# EAGLE design light_sensor (EAGLE 7.3.1)
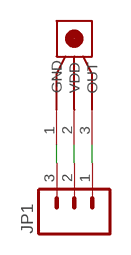
[diagram p0: schematic, sheet 1]

## Parts
JP1  M03PTH  [1X03]
U$1  TSL235TH  [TSL235_TH]

## Nets
N$1: JP1.1 U$1.3(OUT)
N$2: JP1.2 U$1.2(VDD)
N$3: JP1.3 U$1.1(GND)

## Library data of the parts
JP1 = SparkFun:M03: Header 3 Standard 3-pin 0.1" header. Use with straight break away headers (SKU : PRT-00116), right angle break away headers (PRT-00553), swiss pins (PRT-00743), machine pins (PRT-00117), and female headers (PRT-00115). Molex polarized connector foot print use with SKU : PRT-08232 with associated crimp pins and housings.
U$1 = Robin:TSL235

## Board
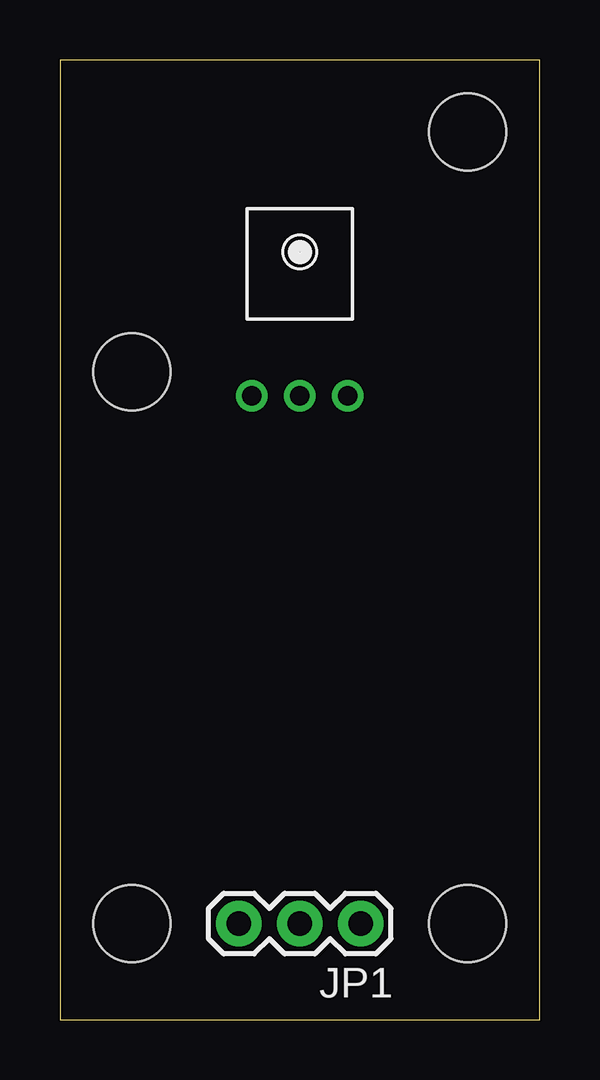
[diagram p1: board, top side]
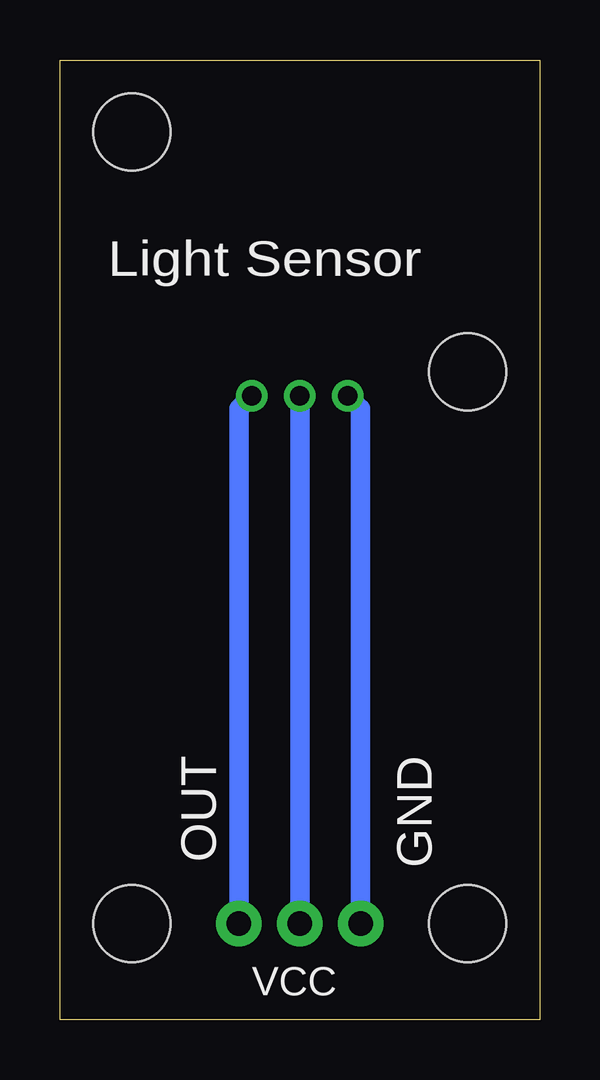
[diagram p2: board, bottom side, seen from below]

Size 20 x 40 mm. Coordinates in mm from the lower left corner, seen from the top.
Outline: 0,0 20,0 20,40 0,40 0,0
Copper layers (1*16): Top 0.035mm / dielectric 1.5mm / Bottom 0.035mm
Design rules "SeeedStudio_2layer_DRU_no_angle_20140221": minimum track width 6mil, minimum drill 12mil, track to track 6mil, track to pad 6mil, pad to pad 6mil, via to via 6mil, smd to smd 0mil, copper to edge 10mil, drill to drill 10mil, minimum pad ring 10mil, minimum via ring 6mil, stop-mask expansion 2mil, vias tented up to drill 100mil, thermal gap 10mil
Holes 3.2 mm at 3,4 17,37 17,4 3,27

### Footprints (pad centres in the part's own frame; a part is rotated, then mirrored left to right if it is on the bottom)
1X03 = drill 1.016 pad 1.88: 1 0,0; 2 2.54,0; 3 5.08,0
TSL235_TH = drill 0.8: 1 -2,-6; 2 0,-6; 3 2,-6

### Placement (x,y rotation side)
JP1  12.54,4 180 top
U$1  10,32 0 top

### Tracks (layer width: path | path; a pad name or v marks a point on that pad's centre or on a via)
N$1
  Bottom 0.813: JP1.1 12.54,25.46 U$1.3
N$2
  Bottom 0.813: JP1.2 U$1.2
N$3
  Bottom 0.813: JP1.3 7.46,25.46 U$1.1

### Text on the board
bPlace: Light Sensor | GND | OUT | VCC